# Altium schematic sheet SY8120B1ABC.SchDoc
size A3
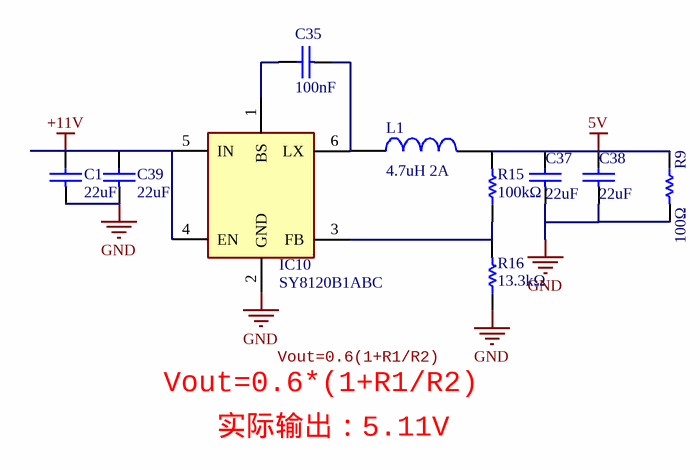
[diagram p0: SY8120B1ABC.SchDoc]

## Parts
C1  22uF  [C_0805]
C35  100nF  [C_0402]
C37  22uF  [C_0805]
C38  22uF  [C_0805]
C39  22uF  [C_0805]
IC10  SY8120B1ABC  [SOT23-6]
L1  4.7uH 2A  [CD32]
R9  100Ω  [R_0805]
R15  100kΩ  [R_0402]
R16  13.3kΩ  [R_0402]

## Nets
5V: C37.2 C38.2 L1.2 R9.1 R15.2
+11V: C1.2 C39.2 IC10.4(EN) IC10.5(IN)
GND: C1.1 C37.1 C38.1 C39.1 IC10.2(GND) R9.2 R16.1
NetC35_1: C35.1 IC10.6(LX) L1.1
NetC35_2: C35.2 IC10.1(BS)
NetIC10_3: IC10.3(FB) R15.1 R16.2

## Notes on the sheet
- Vout=0.6*(1+R1/R2)
- Vout=0.6(1+R1/R2)
- 实际输出：5.11V

## Library data of the parts
C1 C35 C37-C39 = Cap_Chip: 贴片电容; Manufacturer_Name: *; Manufacturer_Part_Number: *
IC10 = SY8120B1ABC: DC-DC芯片; Manufacturer_Name: Silergy; Manufacturer_Part_Number: SY8120B1ABC; ComponentLink1Description: LCSC; ComponentLink1URL: https://item.szlcsc.com/208856.html
L1 = INDUCTOR
R9 R15 R16 = Res_Chip: 贴片电阻; Manufacturer_Name: *; Manufacturer_Part_Number: *